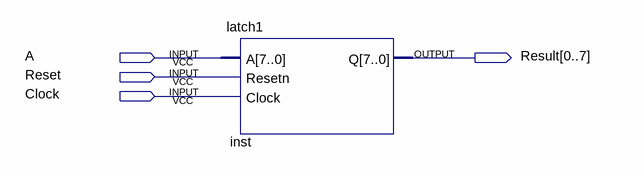
[diagram p0: schematic sheet]
// Quartus schematic latch1Waveform.bdf as structural Verilog: 1 symbols, 4 pins
module latch1Waveform (
  input  A,
  input  Reset,
  input  Clock,
  output [0:7] Result
);

  latch1 inst (.A({8{A}}), .Resetn(Reset), .Clock(Clock), .Q(Result));
endmodule
